# Altium schematic sheet 3V3REGULATOR.SchDoc
size A
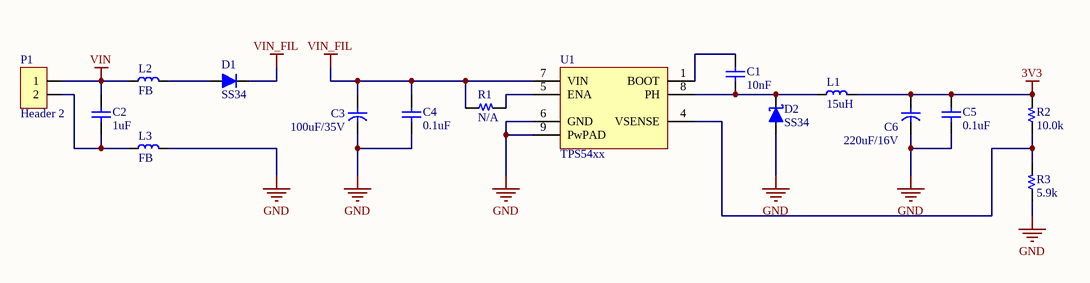
[diagram p0: 3V3REGULATOR.SchDoc]

## Parts
C1  10nF  [C 1206]
C2  1uF  [C 1206]
C3  100uF/35V  [C SMD ALU (D)]
C4  0.1uF  [C 1206]
C5  0.1uF  [C 1206]
C6  220uF/16V  [C SMD ALU (D)]
D1  SS34  [SOD123]
D2  SS34  [SOD123]
L1  15uH  [Inductor SMD 6.5x6.5x3.0]
L2  FB  [L 0805 (2012)]
L3  FB  [L 0805 (2012)]
P1  Header 2  [HDR/Terminal/2]
R1  N/A  [R 0603]
R2  10.0k  [R 0603]
R3  5.9k  [R 0603]
U1  TPS54xx  [SOIC-8 EP]

## Nets
3V3: C5.1 C6.1 L1.2 R2.2
GND: C3.2 C4.2 C5.2 C6.2 D2.1(A) L3.2 R3.1 U1.6(GND) U1.9(PwPAD)
VIN: C2.1 L2.1 P1.1
VIN_FIL: C3.1 C4.1 D1.2(K) R1.1 U1.7(VIN)
NetC1_1: C1.1 U1.1(BOOT)
NetC1_2: C1.2 D2.2(K) L1.1 U1.8(PH)
NetC2_2: C2.2 L3.1 P1.2
NetD1_1: D1.1(A) L2.2
NetR1_2: R1.2 U1.5(ENA)
NetR2_1: R2.1 R3.2 U1.4(VSENSE)

## Library data of the parts
C1 C2 C4 C5 = Capacitor NP: Capacitor non-pol
C3 C6 = Capacitor: Capacitor pol
D1 = Diode: Default Diode
D2 = Diode Schottky: Schottky Diode
L1-L3 = Inductor
P1 = Header 2: Header, 2-Pin
R1-R3 = Resistor
U1 = TPS54xx: 3/5A, Wide input range, Step-down SWIFT DC-DC Converter